# EAGLE design jt-100 (EAGLE 7.2.0)
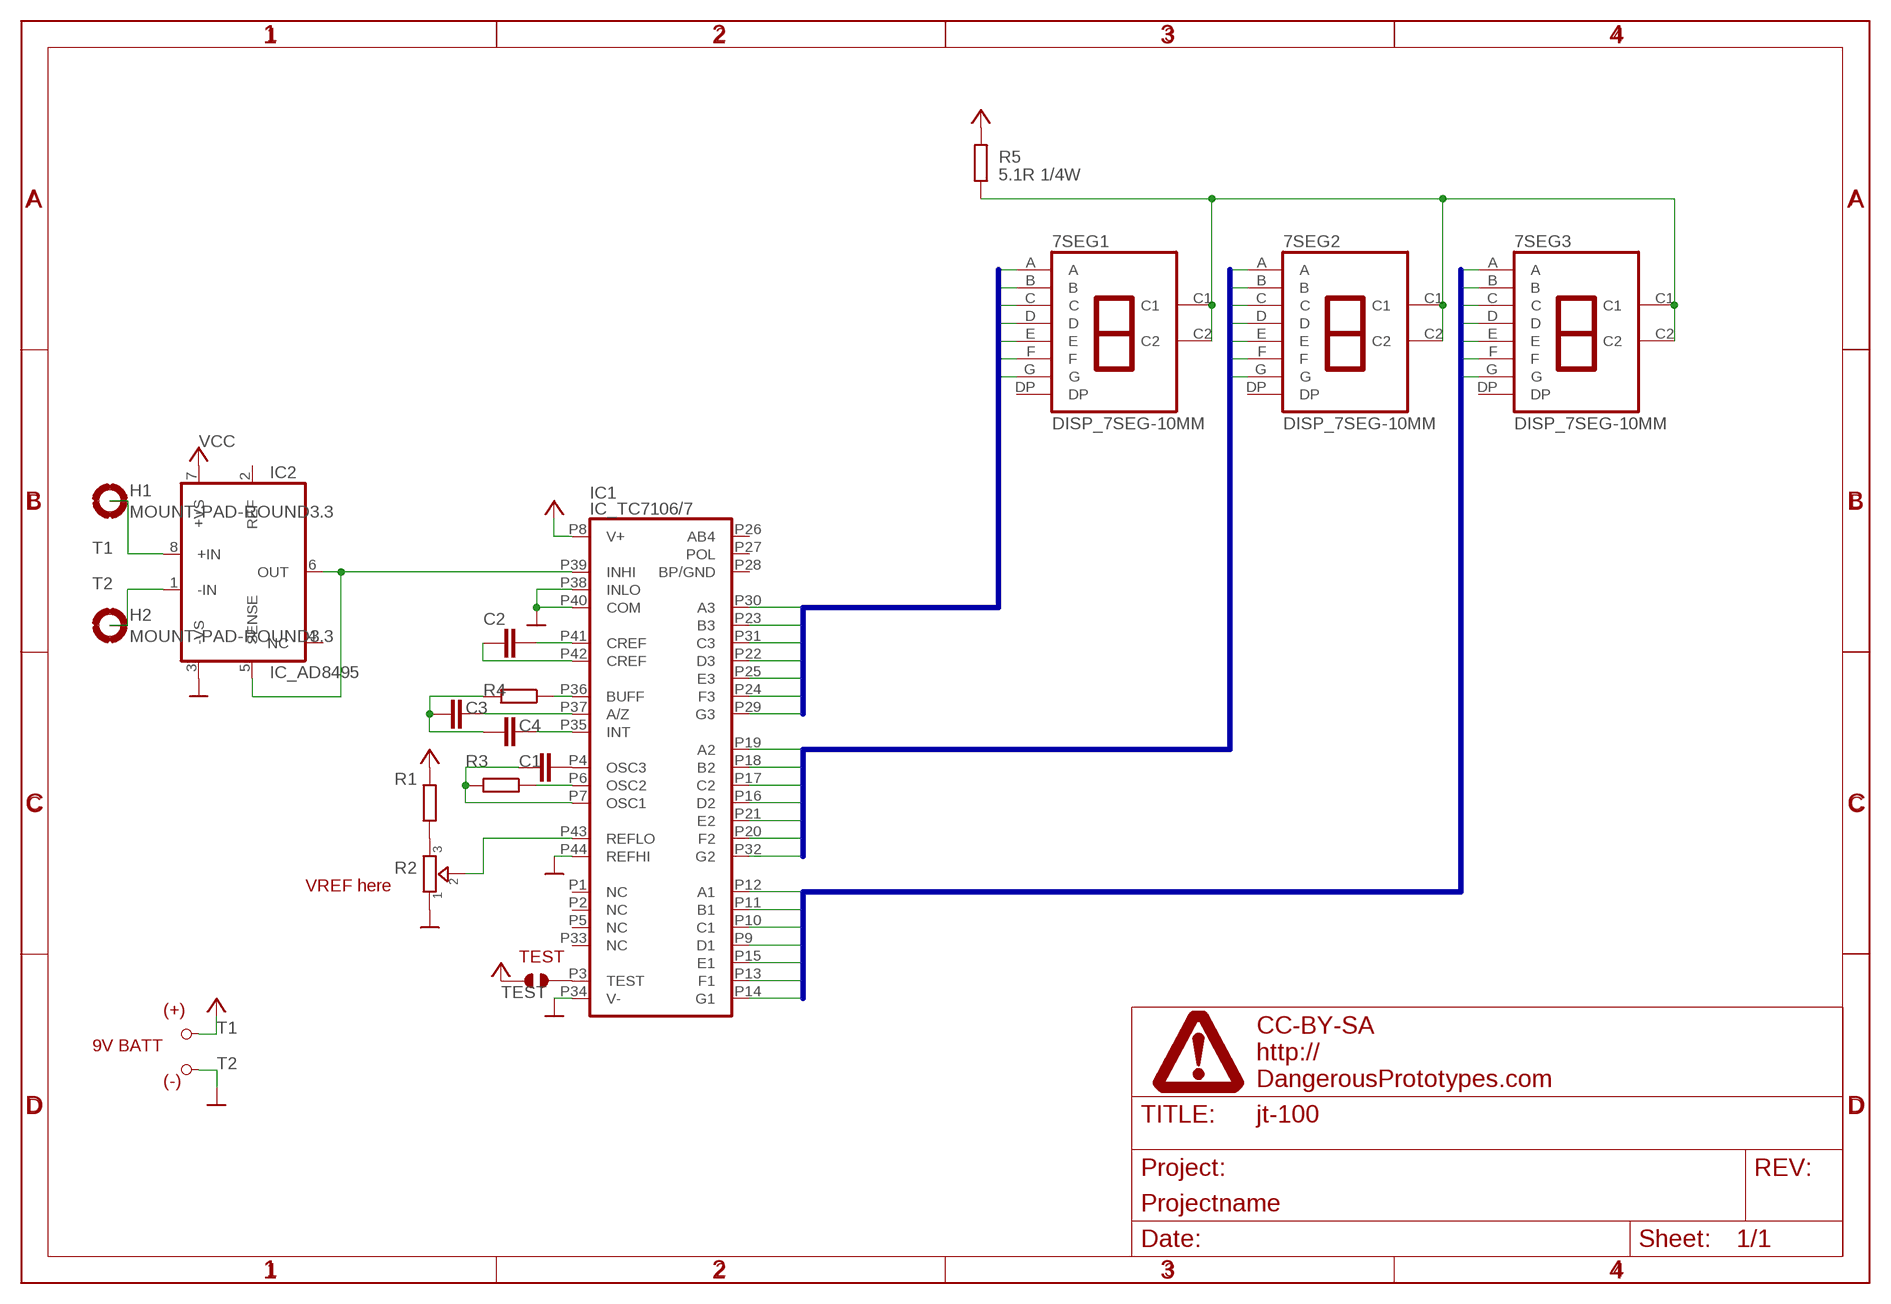
[diagram p0: schematic, sheet 1]

## Parts
7SEG1  DISP_7SEG-10MM  [DISP_7SEG_KTS_4817CKR-P]
7SEG2  DISP_7SEG-10MM  [DISP_7SEG_KTS_4817CKR-P]
7SEG3  DISP_7SEG-10MM  [DISP_7SEG_KTS_4817CKR-P]
C1  CAPACITOR_NPOL-1206  [C1206]
C2  CAPACITOR_NPOL-1206  [C1206]
C3  CAPACITOR_NPOL-1206  [C1206]
C4  CAPACITOR_NPOL-1206  [C1206]
H1  MOUNT-PAD-ROUND3.3  [3,3-PAD]
H2  MOUNT-PAD-ROUND3.3  [3,3-PAD]
IC1  IC_TC7106/7  [TQFP-44]
IC2  IC_AD8495  [MSOP8]
R1  RESISTOR-1206  [R1206]
R2  TRIMMER-3314G  [TRIMMER_3314G]
R3  RESISTOR-1206  [R1206]
R4  RESISTOR-1206  [R1206]
R5  5.1R 1/4W  RESISTOR-1206  [R1206]
T1  PAD_TERMINAL-1.02MM_SQUARE  [CON_PAD_SQUARE_1.02MM]
T2  PAD_TERMINAL-1.02MM_ROUND  [CON_PAD_ROUND_1.02MM]
TEST  JUMPER_SOLDER_1X2  [JUMPER_SOLDER_1X2]
U$1  FRAME_DINA4_L  [DP_LOGO]

## Nets
1S1: 7SEG3.A IC1.P12(A1)
1S2: 7SEG3.B IC1.P11(B1)
1S3: 7SEG3.C IC1.P10(C1)
1S4: 7SEG3.D IC1.P9(D1)
1S5: 7SEG3.E IC1.P15(E1)
1S6: 7SEG3.F IC1.P13(F1)
1S7: 7SEG3.G IC1.P14(G1)
10S1: 7SEG2.A IC1.P19(A2)
10S2: 7SEG2.B IC1.P18(B2)
10S3: 7SEG2.C IC1.P17(C2)
10S4: 7SEG2.D IC1.P16(D2)
10S5: 7SEG2.E IC1.P21(E2)
10S6: 7SEG2.F IC1.P20(F2)
10S7: 7SEG2.G IC1.P32(G2)
100S1: 7SEG1.A IC1.P30(A3)
100S2: 7SEG1.B IC1.P23(B3)
100S3: 7SEG1.C IC1.P31(C3)
100S4: 7SEG1.D IC1.P22(D3)
100S5: 7SEG1.E IC1.P25(E3)
100S6: 7SEG1.F IC1.P24(F3)
100S7: 7SEG1.G IC1.P29(G3)
GND: IC1.P34(V-) IC1.P38(INLO) IC1.P40(COM) IC1.P44(REFHI) IC2.3(-VS) R2.1 T2.P ; supply symbol labelled SUPPLY_GND
N$1: IC1.P39(INHI) IC2.5(SENSE) IC2.6(OUT)
N$2: R1.1 R2.3
N$3: IC1.P43(REFLO) R2.2
N$4: C1.2 IC1.P4(OSC3)
N$5: C1.1 IC1.P7(OSC1) R3.2
N$6: IC1.P6(OSC2) R3.1
N$7: C2.2 IC1.P41(CREF)
N$8: C2.1 IC1.P42(CREF)
N$9: IC1.P36(BUFF) R4.1
N$10: C3.1 C4.1 R4.2
N$11: C3.2 IC1.P37(A/Z)
N$12: C4.2 IC1.P35(INT)
N$13: 7SEG1.C1 7SEG1.C2 7SEG2.C1 7SEG2.C2 7SEG3.C1 7SEG3.C2 R5.1
N$14: IC1.P3(TEST) TEST.2
T1: H1.B3,3(MOUNT) IC2.8(+IN)
T2: H2.B3,3(MOUNT) IC2.1(-IN)
VCC: IC1.P8(V+) IC2.7(+VS) R1.2 R5.2 T1.P TEST.1
Unconnected: 7SEG1.DP 7SEG2.DP 7SEG3.DP IC1.P1(NC) IC1.P2(NC) IC1.P5(NC) IC1.P26(AB4) IC1.P27(POL) IC1.P28(BP/GND) IC1.P33(NC) IC2.2(REF) IC2.4(NC)

## Buses
1S[1..7]
10S[1..7]
100S[1..7]

## Notes on the sheet
- VREF here
- TEST
- (+)
- 9V BATT
- (-)

## Library data of the parts
7SEG1-7SEG3 = dp_devices.v6:DISP_7SEG; MPN: LTS-4817CKR-P; OC_DIGIKEY: 160-1865-2-ND
C1-C4 = dp_devices.v6:CAPACITOR_NPOL: Non-Polarized capacitor in various packages
H1 H2 = Trosh holes:MOUNT-PAD-ROUND: MOUNTING PAD, round
IC1 = dp_devices.v6:IC_TC7106/7: 3-1/2 Digit analog to digital converter http://www.mouser.com/ds/2/268/21455b-3248.pdf; MPN: TC7106CKW; OC_DIGIKEY: TC7106CKW-ND
IC2 = dp_devices.v6:IC_AD8495; MPN: AD8495ARMZ; OC_DIGIKEY: AD8495ARMZ-ND
R1 R3-R5 = dp_devices.v6:RESISTOR
R2 = dp_devices.v6:TRIMMER: Trimmer resistor
T1 T2 = dp_devices.v6:PAD_TERMINAL: Terminal connection pad
TEST = dp_devices.v6:JUMPER_SOLDER_1X2
U$1 = dp_devices.v6:FRAME_DINA4_L: A4 DP frame Standard Dangerous Prototypes schematic frame. Automagically adds the DP logo and standard texts to the PCB Use the atrribute in the schematic editor to change the fields.; FF1: fulfillment by; FF2: Seeed Studio; FF3: www.seeedstudio.com; LICENSE: CC-BY-SA; PROJECT: Projectname; URL1: http://; URL2: DangerousPrototypes.com

## Board
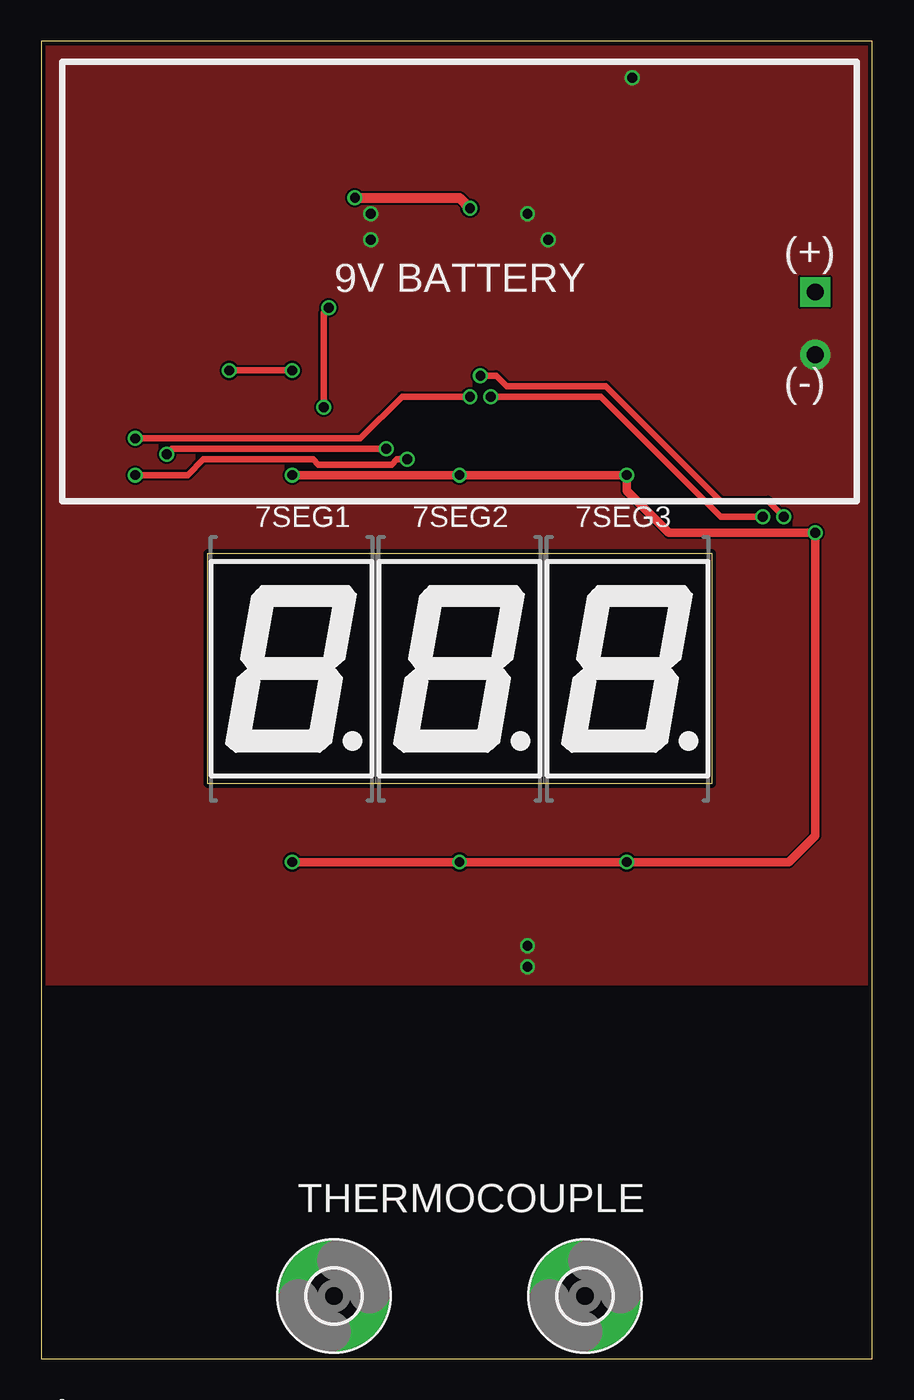
[diagram p1: board, top side]
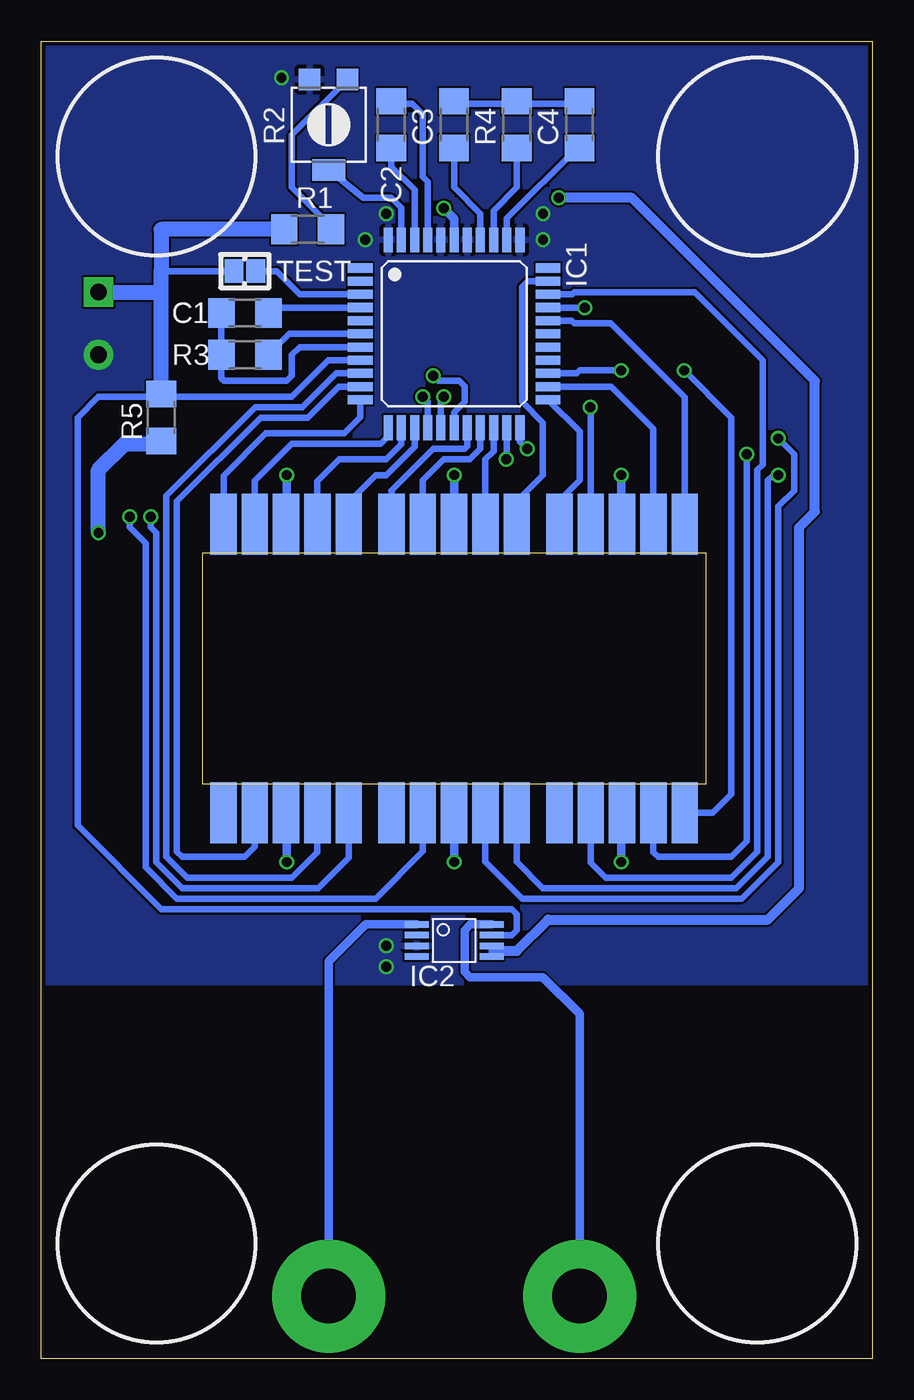
[diagram p2: board, bottom side, seen from below]

Size 50.47 x 80 mm. Coordinates in mm from the lower left corner, seen from the top.
Outline: 0,0 50.47,0 50.47,80 0,80 0,0
Outline: 10.1,48.91 40.7,48.91 40.7,34.91 10.1,34.91 10.1,48.91
Copper layers (1*16): Top 0.035mm / dielectric 1.5mm / Bottom 0.035mm
Design rules "dirt_cheap_dirty_boards.v1": minimum track width 5mil, minimum drill 12mil, track to track 5mil, track to pad 5mil, pad to pad 5mil, via to via 5mil, smd to smd 0mil, copper to edge 10mil, drill to drill 10mil, minimum pad ring 10mil, minimum via ring 6mil, stop-mask expansion 2mil, vias tented up to drill 25mil, thermal gap 10mil

### Footprints (pad centres in the part's own frame; a part is rotated, then mirrored left to right if it is on the bottom)
DISP_7SEG_KTS_4817CKR-P = smd 1.6 x 3.7 bottom: A 1.9,8.75; B 3.8,8.75; C 1.9,-8.75; C1 0,-8.75; C2 0,8.75; D -1.9,-8.75; DP 3.8,-8.75; E -3.8,-8.75; F -1.9,8.75; G -3.8,8.75
C1206 = smd 1.6 x 1.803: 1 -1.422,0; 2 1.422,0
3,3-PAD = drill 3.3 pad 6.858: B3,3 0,0
TQFP-44 = smd 0.55 x 1.5: P1 -4,-5.7; P2 -3.2,-5.7; P3 -2.4,-5.7; P4 -1.6,-5.7; P5 -0.8,-5.7; P6 0,-5.7; P7 0.8,-5.7; P8 1.6,-5.7; P9 2.4,-5.7; P10 3.2,-5.7; P11 4,-5.7; P23 4,5.7; P24 3.2,5.7; P25 2.4,5.7; P26 1.6,5.7; P27 0.8,5.7; P28 0,5.7; P29 -0.8,5.7; P30 -1.6,5.7; P31 -2.4,5.7; P32 -3.2,5.7; P33 -4,5.7 | smd 1.5 x 0.55: P12 5.7,-4; P13 5.7,-3.2; P14 5.7,-2.4; P15 5.7,-1.6; P16 5.7,-0.8; P17 5.7,0; P18 5.7,0.8; P19 5.7,1.6; P20 5.7,2.4; P21 5.7,3.2; P22 5.7,4; P34 -5.7,4; P35 -5.7,3.2; P36 -5.7,2.4; P37 -5.7,1.6; P38 -5.7,0.8; P39 -5.7,0; P40 -5.7,-0.8; P41 -5.7,-1.6; P42 -5.7,-2.4; P43 -5.7,-3.2; P44 -5.7,-4
MSOP8 = smd 0.4 x 1.45: 1 -0.975,-2.275; 2 -0.325,-2.275; 3 0.325,-2.275; 4 0.975,-2.275; 5 0.975,2.275; 6 0.325,2.275; 7 -0.325,2.275; 8 -0.975,2.275
R1206 = smd 1.6 x 1.803: 1 -1.422,0; 2 1.422,0
TRIMMER_3314G = smd 1.3 x 1.3: 1 -1.15,2.75; 3 1.15,2.75 | smd 2 x 1.3: 2 0,-2.75
CON_PAD_SQUARE_1.02MM = drill 1.02 pad 1.81 square: P 0,0
CON_PAD_ROUND_1.02MM = drill 1.02 pad 1.81: P 0,0
JUMPER_SOLDER_1X2 = smd 1.143 x 1.422: 1 -0.66,0; 2 0.66,0

### Placement (x,y rotation side)
7SEG1  15.2,41.91 0 top
7SEG2  25.4,41.91 0 top
7SEG3  35.6,41.91 0 top
C1  38.1,63.5 0 bottom
C2  29.21,74.93 90 bottom
C3  25.4,74.93 270 bottom
C4  17.78,74.93 270 bottom
H1  17.78,3.81 0 top
H2  33.02,3.81 0 top
IC1  25.4,62.23 270 bottom
IC2  25.4,25.4 270 bottom
R1  34.29,68.58 180 bottom
R2  33.02,74.93 0 bottom
R3  38.1,60.96 180 bottom
R4  21.59,74.93 90 bottom
R5  43.18,57.15 90 bottom
T1  46.99,64.77 0 bottom
T2  46.99,60.96 0 bottom
TEST  38.1,66.04 0 bottom
U$1  1.27,-5.08 0 top  (outside the outline)

### Tracks (layer width: path | path; a pad name or v marks a point on that pad's centre or on a via)
1S1
  Bottom 0.406: IC1.P12 29.4,56.01 29.84,55.56 35.24,55.56 37.5,53.3 7SEG3.A
1S2
  Bottom 0.406: IC1.P11 31.1,57.16 32.07,56.2 36.83,56.2 39.4,53.63 7SEG3.B
1S3
  Bottom 0.406: 7SEG3.C 37.5,31.08 38.1,30.48 41.91,30.48 42.23,30.8 42.23,52.07 37.15,57.15 34.29,57.15 32.41,59.03 IC1.P10
1S4
  Bottom 0.406: 7SEG3.D 33.7,30.75 35.24,29.21 41.59,29.21 42.86,30.48 42.86,52.39 37.47,57.78 34.61,57.78 32.56,59.83 IC1.P9
1S5  (via drill 0.6)
  Top 0.406: v27.3,58.42 33.97,58.42 41.27,51.12 v43.81,51.12
  Bottom 0.406: 7SEG3.E 31.8,30.43 33.66,28.57 41.91,28.57 43.5,30.16 43.5,50.16 43.81,50.48 v43.81,51.12 | IC1.P15 27,58.12 v27.3,58.42
1S6
  Bottom 0.406: IC1.P13 28.6,55.54 29.53,54.61 32.38,54.61 33.7,53.3 7SEG3.F
1S7
  Bottom 0.406: IC1.P14 27.8,55.38 29.53,53.66 30.16,53.66 31.8,52.02 7SEG3.G
10S1
  Bottom 0.406: IC1.P19 23.8,55.26 24.45,54.61 26.04,54.61 27.3,53.34 7SEG2.A
10S2
  Bottom 0.406: IC1.P18 24.6,55.41 24.77,55.24 26.67,55.24 29.21,52.7 29.2,52.7 7SEG2.B
10S3  (via drill 0.6)
  Top 0.406: v26.67,59.69 27.62,59.69 28.26,59.05 34.29,59.05 41.27,52.07 44.13,52.07 v45.09,51.12
  Bottom 0.406: 7SEG2.C 27.3,30.8 30.16,27.94 42.23,27.94 44.13,29.84 44.13,49.53 45.09,50.48 v45.09,51.12 | IC1.P17 25.4,57.47 24.77,58.1 24.77,59.05 25.08,59.37 26.35,59.37 v26.67,59.69
10S4  (via drill 0.6)
  Top 0.406: v5.71,55.88 19.37,55.88 21.91,58.42 v26.04,58.42
  Bottom 0.406: 7SEG2.D 23.5,30.17 21.27,27.94 7.94,27.94 5.71,30.16 5.71,51.75 4.76,52.7 4.76,54.93 v5.71,55.88 | IC1.P16 26.2,58.26 v26.04,58.42
10S5  (via drill 0.6)
  Top 0.406: v22.23,54.61 21.59,54.61 21.27,54.29 16.83,54.29 16.51,54.61 9.84,54.61 8.89,53.66 v5.71,53.66
  Bottom 0.406: 7SEG2.E 21.6,30.17 20,28.57 8.26,28.57 6.35,30.48 6.35,53.34 6.03,53.66 v5.71,53.66 | IC1.P21 22.2,54.63 v22.23,54.61
10S6
  Bottom 0.406: 7SEG2.F 23.5,53.97 23.5,54.61 23,55.1 IC1.P20
10S7
  Bottom 0.406: 7SEG2.G 21.6,52.06 20,53.66 20,56.83 21.27,58.1 21.27,65.09 20.93,65.43 IC1.P32
100S1  (via drill 0.6)
  Top 0.406: v17.14,57.78 17.14,63.5 v17.46,63.82
  Bottom 0.406: 7SEG1.A 17.1,57.74 v17.14,57.78 | v17.46,63.82 19.69,63.82 IC1.P30
100S2
  Bottom 0.406: 7SEG1.B 19,52.12 17.78,53.34 17.78,56.31 IC1.P23
100S3
  Bottom 0.406: 7SEG1.C 17.1,30.12 16.19,29.21 8.57,29.21 6.99,30.8 6.99,53.98 6.67,54.29 6.67,60.64 10.79,64.77 18.1,64.77 18.24,64.63 IC1.P31
100S4  (via drill 0.6)
  Top 0.406: v20.95,55.24 7.94,55.24 v7.62,54.93
  Bottom 0.406: 7SEG1.D 13.3,30.76 13.02,30.48 8.57,30.48 7.62,31.43 v7.62,54.93 | IC1.P22 21.4,55.69 v20.95,55.24
100S5  (via drill 0.6)
  Top 0.406: v11.43,60.01 v15.24,60.01
  Bottom 0.406: 7SEG1.E 9.7,33.16 8.57,34.29 8.57,57.15 v11.43,60.01 | v15.24,60.01 17.78,60.01 17.96,59.83 IC1.P25
100S6
  Bottom 0.406: 7SEG1.F 13.3,56.48 15.85,59.03 IC1.P24
100S7
  Bottom 0.406: 7SEG1.G 11.4,58.39 15.88,62.87 18.1,62.87 18.26,63.03 IC1.P29
GND  (via drill 0.6)
  other vias: 20,67.94 20,69.53 29.53,23.81 29.53,25.08 29.53,69.53 30.8,67.94 35.88,77.79
  pour Bottom (rank 6): 0,80.01 50.8,80.01 50.8,22.86 0,22.86
  pour Top (rank 6): 0,80.01 50.8,80.01 50.8,22.86 0,22.86
N$1  (via drill 0.6)
  Top 0.61: v19.05,70.48 25.4,70.48 v26.04,69.85
  Bottom 0.406: IC2.5 IC2.6 23.12,25.03 22.86,24.77
  Bottom 0.508: IC1.P39 25.4,69.22 v26.04,69.85
  Bottom 0.61: 22.86,24.77 21.59,24.77 19.68,26.67 6.35,26.67 4.45,28.57 4.45,50.48 3.49,51.44 3.49,59.37 14.61,70.48 v19.05,70.48
N$2
  Bottom 0.406: 33.02,68.58 R1.1 32.87,68.75 35.24,71.12 35.24,74.31 R2.3
N$3
  Bottom 0.406: IC1.P43 28.6,69.88 29.21,70.48 30.91,70.48 R2.2
N$4
  Bottom 0.406: IC1.P4 36.35,63.83 C1.2
N$5
  Bottom 0.406: IC1.P7 34.77,61.43 35.24,60.96 35.24,59.69 35.56,59.37 39.37,59.37 39.52,59.52 R3.2 C1.1
N$6
  Bottom 0.406: IC1.P6 35.41,62.23 R3.1
N$7
  Bottom 0.406: IC1.P41 27,71.45 27.3,71.75 27.3,75.56 27.94,76.2 29.06,76.2 C2.2
N$8
  Bottom 0.406: IC1.P42 27.8,70.98 29.21,72.39 C2.1
N$9
  Bottom 0.406: IC1.P36 23,69.71 21.59,71.12 R4.1
N$10
  Bottom 0.406: C3.1 25.4,76.2 21.74,76.2 R4.2 21.59,76.2 17.93,76.2 C4.1
N$11
  Bottom 0.406: IC1.P37 23.8,69.52 25.4,71.12 C3.2
N$12
  Bottom 0.406: IC1.P35 22.2,69.24 17.93,73.51 C4.2
N$13  (via drill 0.6)
  Top 0.508: v15.24,30.16 v25.4,30.16 v35.56,30.16 45.4,30.16 46.99,31.75 v46.99,50.16 38.1,50.16 35.56,52.7 v35.56,53.66 v25.4,53.66 v15.24,53.66
  Bottom 0.406: 7SEG3.C1 35.6,33.06 35.56,33.02
  Bottom 0.508: 35.56,33.02 v35.56,30.16 | 7SEG2.C1 v25.4,30.16 | 7SEG1.C1 15.2,33.06 15.24,33.02 v15.24,30.16 | 7SEG3.C2 35.6,50.76 35.56,50.8 v35.56,53.66 | 7SEG2.C2 v25.4,53.66 | 7SEG1.C2 15.2,50.76 15.24,50.8 v15.24,53.66
  Bottom 0.914: v46.99,50.16 46.99,53.98 45.4,55.56 43.35,55.56 R5.1
N$14
  Bottom 0.406: IC1.P3 34.76,64.63 36.17,66.04 TEST.2
T1
  Bottom 0.508: IC2.8 24.43,26.38 24.77,26.04 24.77,23.5 24.45,23.18 20,23.18 17.78,20.95 H1.B3,3
T2
  Bottom 0.508: IC2.1 30.77,26.38 33.02,24.13 H2.B3,3
VCC
  Bottom 0.406: TEST.1 43.18,66.04 | IC1.P8 33.03,60.63 35.24,58.42 43.03,58.42 | 43.03,58.42 R5.2 | 43.03,58.42 46.99,58.42 48.26,57.15 48.26,32.38 43.18,27.3 21.91,27.3 21.59,26.99 21.59,26.04 21.91,25.72 IC2.7
  Bottom 0.914: R5.2 43.18,64.77 | 43.18,64.77 43.18,66.04 43.18,68.58 R1.2 | T1.P 43.18,64.77

### Text on the board
tPlace: (+) | 9V BATTERY | (-) | THERMOCOUPLE